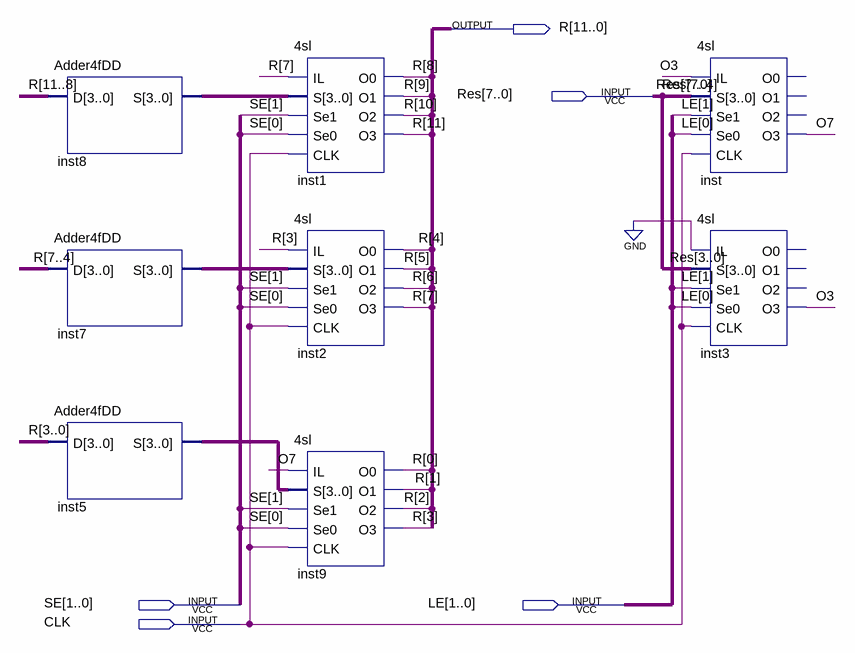
[diagram p0: schematic sheet]
// Quartus schematic 20sl.bdf as structural Verilog: 8 symbols, 5 pins
module \20sl  (
  input  [7:0] Res,
  input  [1:0] SE,
  input  [1:0] LE,
  input  CLK,
  output [11:0] R
);

  wire O3, O7;
  wire [3:0] inst5_s, inst7_s, inst8_s;

  Adder4fDD inst8 (.D(R[11:8]), .S(inst8_s));
  Adder4fDD inst7 (.D(R[7:4]), .S(inst7_s));
  Adder4fDD inst5 (.D(R[3:0]), .S(inst5_s));
  \4sl  inst1 (
    .IL(R[7]), .S(inst8_s), .Se1(SE[1]), .Se0(SE[0]), .CLK(CLK), .O0(R[8]), .O1(R[9]), .O2(R[10]), .O3(R[11]));
  \4sl  inst2 (.IL(R[3]), .S(inst7_s), .Se1(SE[1]), .Se0(SE[0]), .CLK(CLK), .O0(R[4]), .O1(R[5]), .O2(R[6]), .O3(R[7]));
  \4sl  inst9 (.IL(O7), .S(inst5_s), .Se1(SE[1]), .Se0(SE[0]), .CLK(CLK), .O0(R[0]), .O1(R[1]), .O2(R[2]), .O3(R[3]));
  \4sl  inst (.IL(O3), .S(Res[7:4]), .Se1(LE[1]), .Se0(LE[0]), .CLK(CLK), .O3(O7));  // open: O0, O1, O2
  \4sl  inst3 (.IL(1'b0), .S(Res[3:0]), .Se1(LE[1]), .Se0(LE[0]), .CLK(CLK), .O3(O3));  // open: O0, O1, O2
endmodule
